# EasyEDA schematic SCH_orion-rf_2026-05-15.json
TITLE: ORION_RF; REV: 1.0; Date: 2026-02-12; Sheet: 1/1; Drawn By: krolyxon; Company: krolyxon inc.
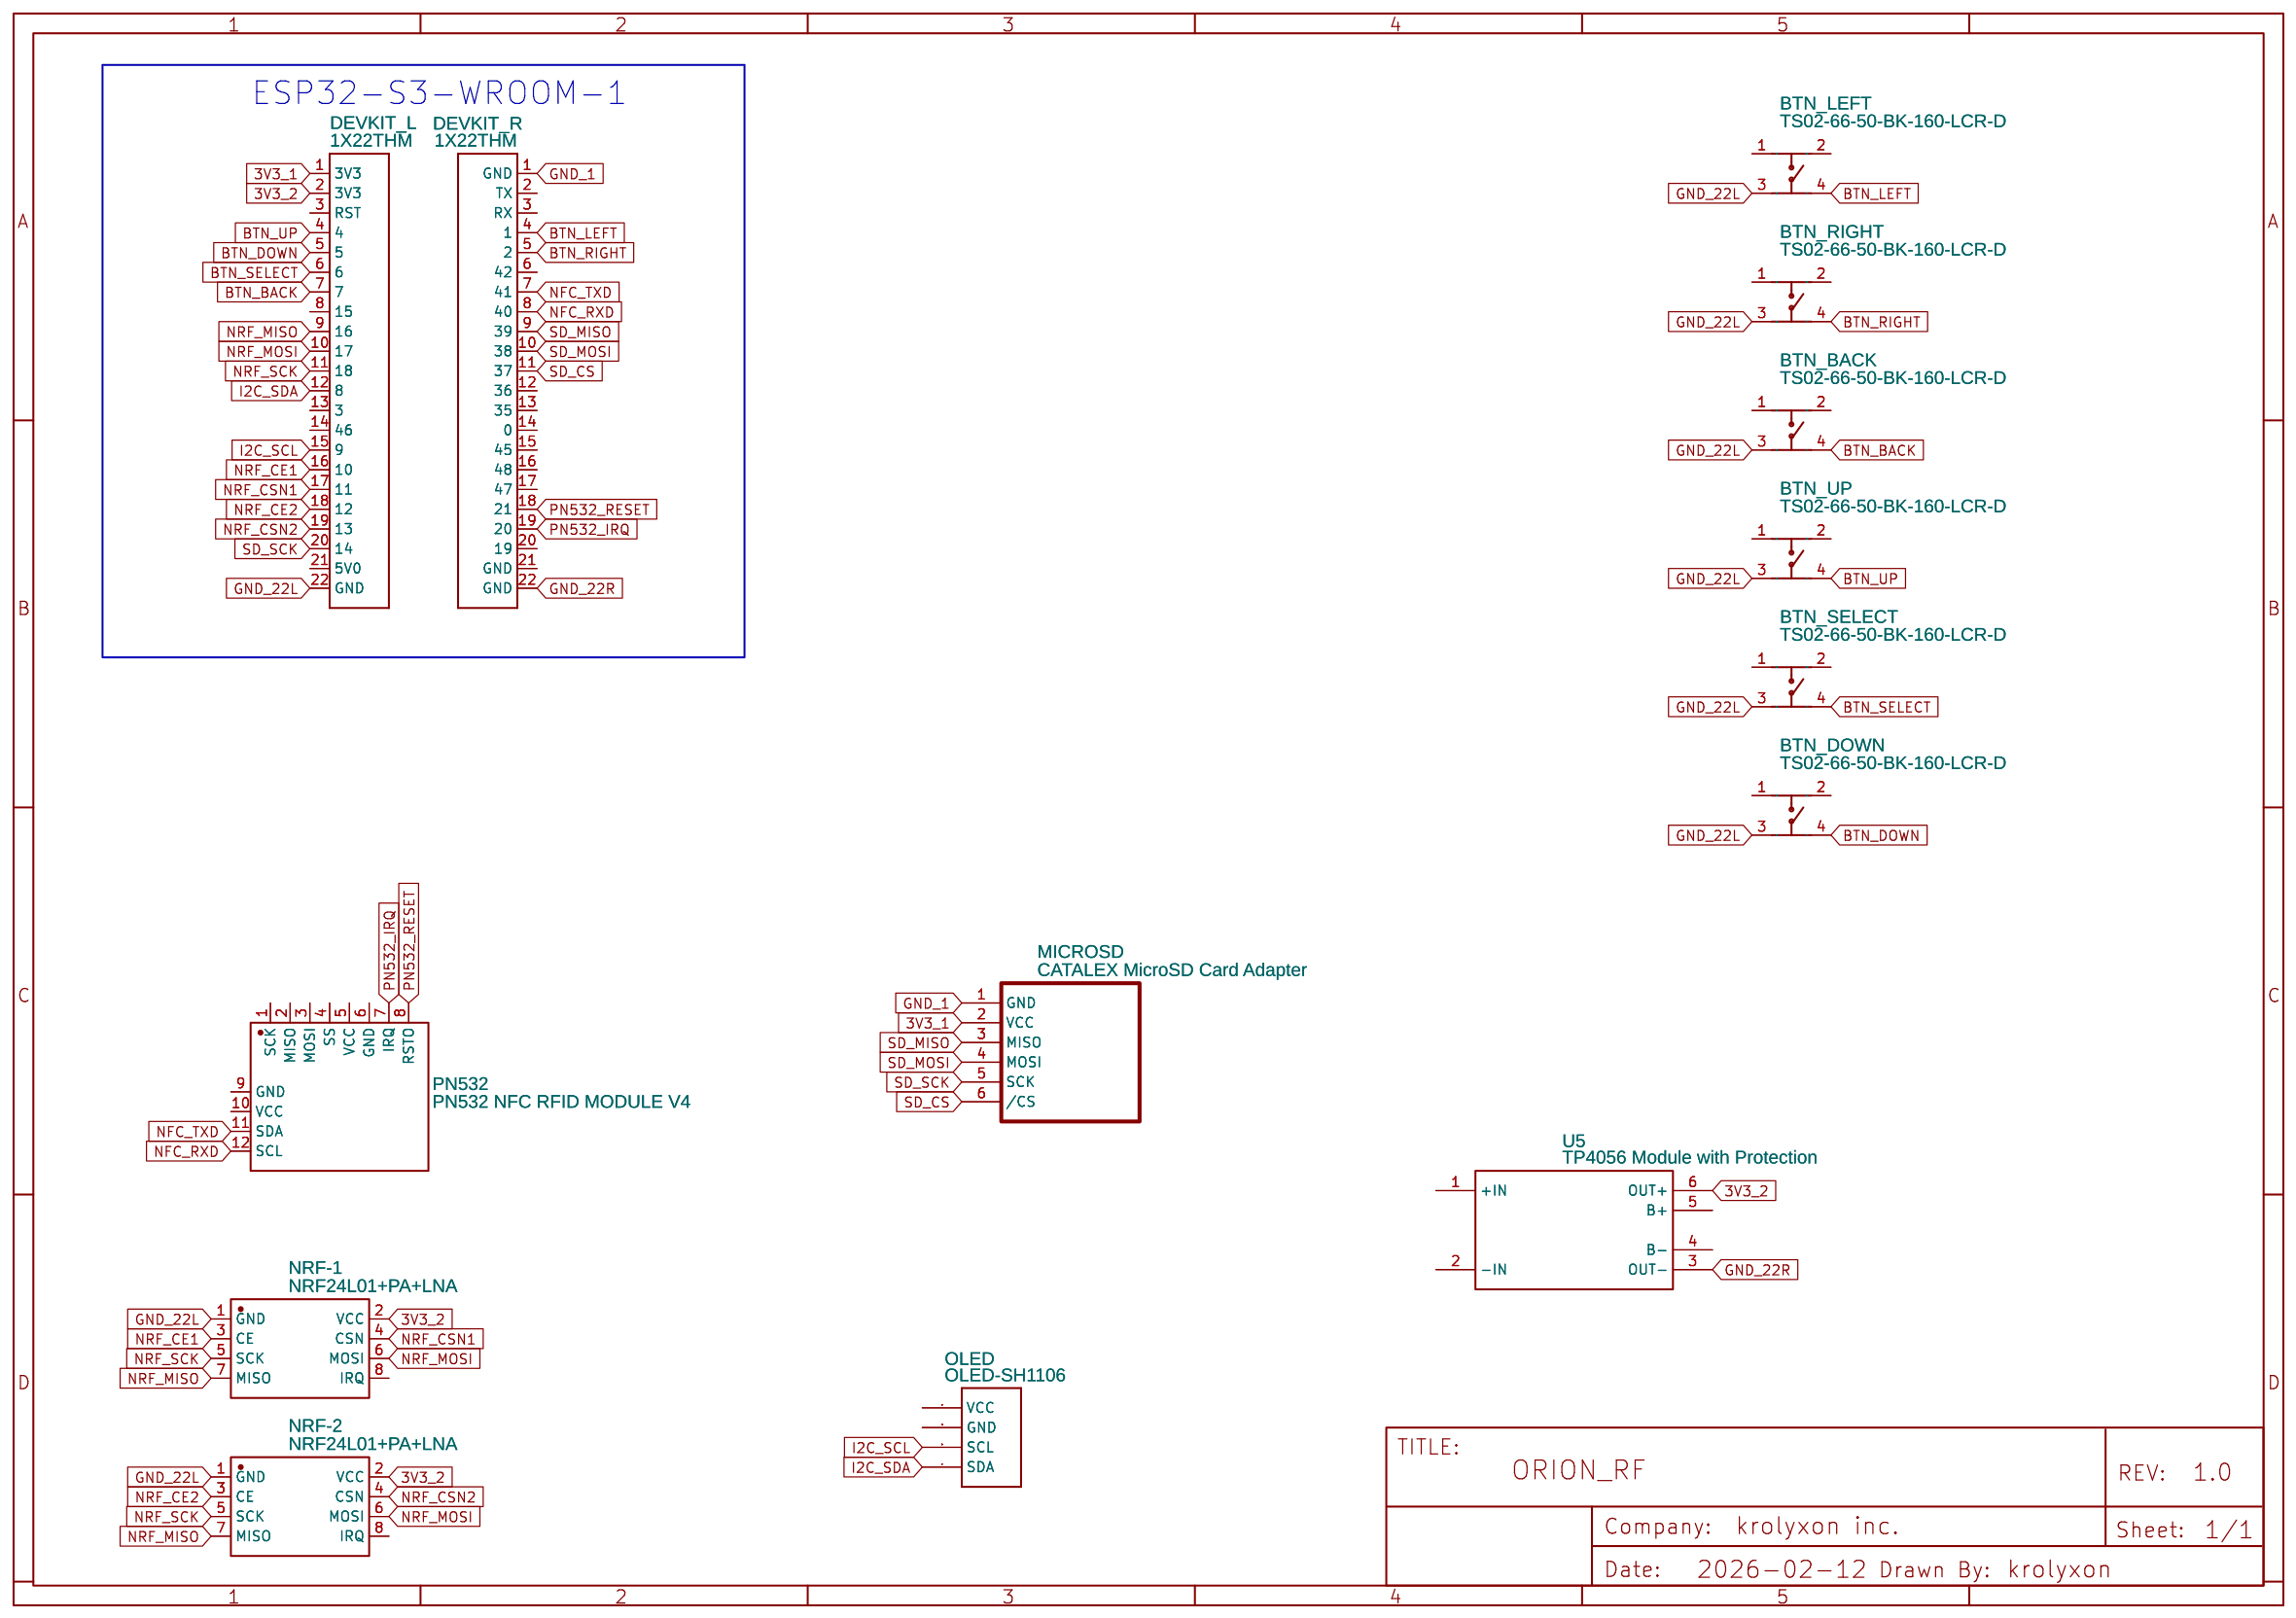
[diagram p0: schematic sheet]

## Parts
BTN_BACK  TS02-66-50-BK-160-LCR-D  [SW-TH_4P-L6.0-W6.0-P4.50-LS6.5]
BTN_DOWN  TS02-66-50-BK-160-LCR-D  [SW-TH_4P-L6.0-W6.0-P4.50-LS6.5]
BTN_LEFT  TS02-66-50-BK-160-LCR-D  [SW-TH_4P-L6.0-W6.0-P4.50-LS6.5]
BTN_RIGHT  TS02-66-50-BK-160-LCR-D  [SW-TH_4P-L6.0-W6.0-P4.50-LS6.5]
BTN_SELECT  TS02-66-50-BK-160-LCR-D  [SW-TH_4P-L6.0-W6.0-P4.50-LS6.5]
BTN_UP  TS02-66-50-BK-160-LCR-D  [SW-TH_4P-L6.0-W6.0-P4.50-LS6.5]
DEVKIT_L  1X22THM  [1X22]
DEVKIT_R  1X22THM  [1X22]
MICROSD  CATALEX MicroSD Card Adapter  [CATALEX MICROSD CARD ADAPTER]
NRF-1  NRF24L01+PA+LNA  [COMM-TH_L41.0-W15.5-P2.54_NRF24L01]
NRF-2  NRF24L01+PA+LNA  [COMM-TH_L41.0-W15.5-P2.54_NRF24L01]
OLED  OLED-SH1106  [OLED_SH1106]
PN532  PN532 NFC RFID MODULE V4  [COMM-TH_L42.7-W40.4_PN532_NFC_RFID]
U5  TP4056 Module with Protection  [TP4056 MODULE WITH PROTECTION]

## Library data of the parts
BTN_BACK BTN_DOWN BTN_LEFT BTN_RIGHT BTN_SELECT BTN_UP = TS02-66-50-BK-160-LCR-D: Contributor: lcsc; Supplier: LCSC; Supplier Part: C4364884; Manufacturer: CUI
DEVKIT_L DEVKIT_R = 1X22THM: Contributor: Adafruit
MICROSD = CATALEX MicroSD Card Adapter: sourceId: PKkG2MKHF; Contributor: alejandra.amaya1
NRF-1 NRF-2 = NRF24L01+PA+LNA: Supplier: LCSC; Supplier Part: C9900187674; Manufacturer: null; Manufacturer Part: nRF24L01+PA+LNA; JLCPCB Part Class: Extended Part; Contributor: lcsc
OLED = OLED-SH1106: Contributor: 11216022; sourceId: WJxhbtn3X
PN532 = PN532 NFC RFID MODULE V4: Supplier: LCSC; Supplier Part: C9900233104; Manufacturer: null; Manufacturer Part: PN532 NFC RFID Module v4; Contributor: lcsc
U5 = TP4056 Module with Protection: Supplier: LCSC; Contributor: obyy1234567890

## Nets
3V3_1: DEVKIT_L.1(3V3) MICROSD.2(VCC)
3V3_2: DEVKIT_L.2(3V3) NRF-1.2(VCC) NRF-2.2(VCC) U5.6(OUT+)
GND_1: DEVKIT_R.1(GND) MICROSD.1(GND)
GND_22L: BTN_BACK.3 BTN_DOWN.3 BTN_LEFT.3 BTN_RIGHT.3 BTN_SELECT.3 BTN_UP.3 DEVKIT_L.22(GND) NRF-1.1(GND) NRF-2.1(GND)
GND_22R: DEVKIT_R.22(GND) U5.3(OUT-)
BTN_BACK: BTN_BACK.4 DEVKIT_L.7
BTN_DOWN: BTN_DOWN.4 DEVKIT_L.5
BTN_LEFT: BTN_LEFT.4 DEVKIT_R.4(1)
BTN_RIGHT: BTN_RIGHT.4 DEVKIT_R.5(2)
BTN_SELECT: BTN_SELECT.4 DEVKIT_L.6
BTN_UP: BTN_UP.4 DEVKIT_L.4
I2C_SCL: DEVKIT_L.15(9) OLED.3(SCL)
I2C_SDA: DEVKIT_L.12(8) OLED.4(SDA)
NFC_RXD: DEVKIT_R.8(40) PN532.12(SCL)
NFC_TXD: DEVKIT_R.7(41) PN532.11(SDA)
NRF_CE1: DEVKIT_L.16(10) NRF-1.3(CE)
NRF_CE2: DEVKIT_L.18(12) NRF-2.3(CE)
NRF_CSN1: DEVKIT_L.17(11) NRF-1.4(CSN)
NRF_CSN2: DEVKIT_L.19(13) NRF-2.4(CSN)
NRF_MISO: DEVKIT_L.9(16) NRF-1.7(MISO) NRF-2.7(MISO)
NRF_MOSI: DEVKIT_L.10(17) NRF-1.6(MOSI) NRF-2.6(MOSI)
NRF_SCK: DEVKIT_L.11(18) NRF-1.5(SCK) NRF-2.5(SCK)
PN532_IRQ: DEVKIT_R.19(20) PN532.7(IRQ)
PN532_RESET: DEVKIT_R.18(21) PN532.8(RSTO)
SD_CS: DEVKIT_R.11(37) MICROSD.6(/CS)
SD_MISO: DEVKIT_R.9(39) MICROSD.3(MISO)
SD_MOSI: DEVKIT_R.10(38) MICROSD.4(MOSI)
SD_SCK: DEVKIT_L.20(14) MICROSD.5(SCK)

Not connected (* = marked no-connect by the designer): BTN_BACK 1 2; BTN_DOWN 1 2; BTN_LEFT 1 2; BTN_RIGHT 1 2; BTN_SELECT 1 2; BTN_UP 1 2; DEVKIT_L 3(RST) 8(15) 13(3) 14(46) 21(5V0); DEVKIT_R 2(TX) 3(RX) 6(42) 12(36) 13(35) 14(0) 15(45) 16(48) 17(47) 20(19) 21(GND); NRF-1 8(IRQ); NRF-2 8(IRQ); OLED 1(VCC) 2(GND); PN532 1(SCK) 2(MISO) 3(MOSI) 4(SS) 5(VCC) 6(GND) 9(GND) 10(VCC); U5 1(+IN) 2(-IN) 4(B-) 5(B+)

## Notes on the sheet
- ESP32-S3-WROOM-1
